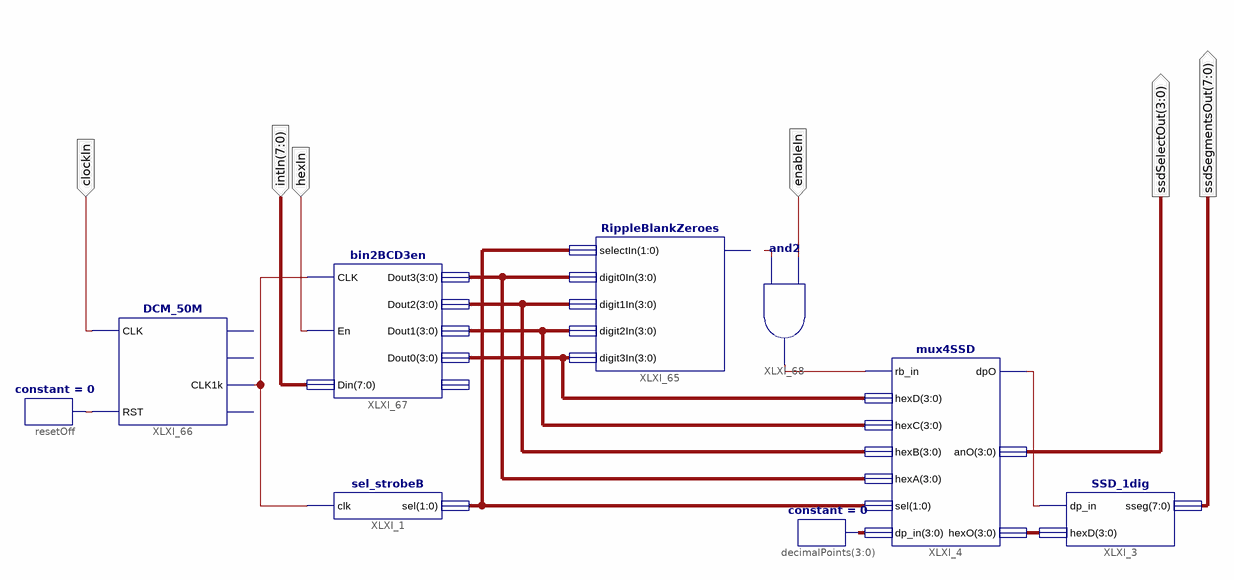
[diagram p0: schematic sheet 1]
// Xilinx ISE schematic SsdDrive8b.sch (spartan3e) as structural Verilog: 9 symbols, 6 ports
module SsdDrive8b (
  input  clockIn,
  input  [7:0] intIn,
  input  hexIn,
  input  enableIn,
  output [3:0] ssdSelectOut,
  output [7:0] ssdSegmentsOut
);

  wire XLXN_17, XLXN_298, XLXN_395, XLXN_461, XLXN_462;
  wire [1:0] XLXN_459;
  wire [3:0] XLXN_18, XLXN_367, XLXN_368, XLXN_369, XLXN_370, XLXN_456;

  RippleBlankZeroes XLXI_65 (
    .selectIn(XLXN_459), .digit0In(XLXN_370), .digit1In(XLXN_369), .digit2In(XLXN_368), .digit3In(XLXN_367));  // open: rippleBlankOut
  bin2BCD3en XLXI_67 (
    .CLK(XLXN_395), .En(hexIn), .Din(intIn), .Dout3(XLXN_370), .Dout2(XLXN_369), .Dout1(XLXN_368),
    .Dout0(XLXN_367));  // open: RBout
  constant #(.CValue("0")) resetOff (.O(XLXN_298));
  DCM_50M XLXI_66 (.CLK(clockIn), .RST(XLXN_298), .CLK1k(XLXN_395));  // open: CLK1M, CLK10k, CLK1
  and XLXI_68 (XLXN_462, XLXN_461, enableIn);
  sel_strobeB XLXI_1 (.clk(XLXN_395), .sel(XLXN_459));
  SSD_1dig XLXI_3 (.dp_in(XLXN_17), .hexD(XLXN_18), .sseg(ssdSegmentsOut));
  mux4SSD XLXI_4 (
    .rb_in(XLXN_462), .hexD(XLXN_367), .hexC(XLXN_368), .hexB(XLXN_369), .hexA(XLXN_370), .sel(XLXN_459),
    .dp_in(XLXN_456), .dpO(XLXN_17), .anO(ssdSelectOut), .hexO(XLXN_18));
  constant #(.CValue("0")) decimalPoints[3:0] (.O(XLXN_456));
endmodule
